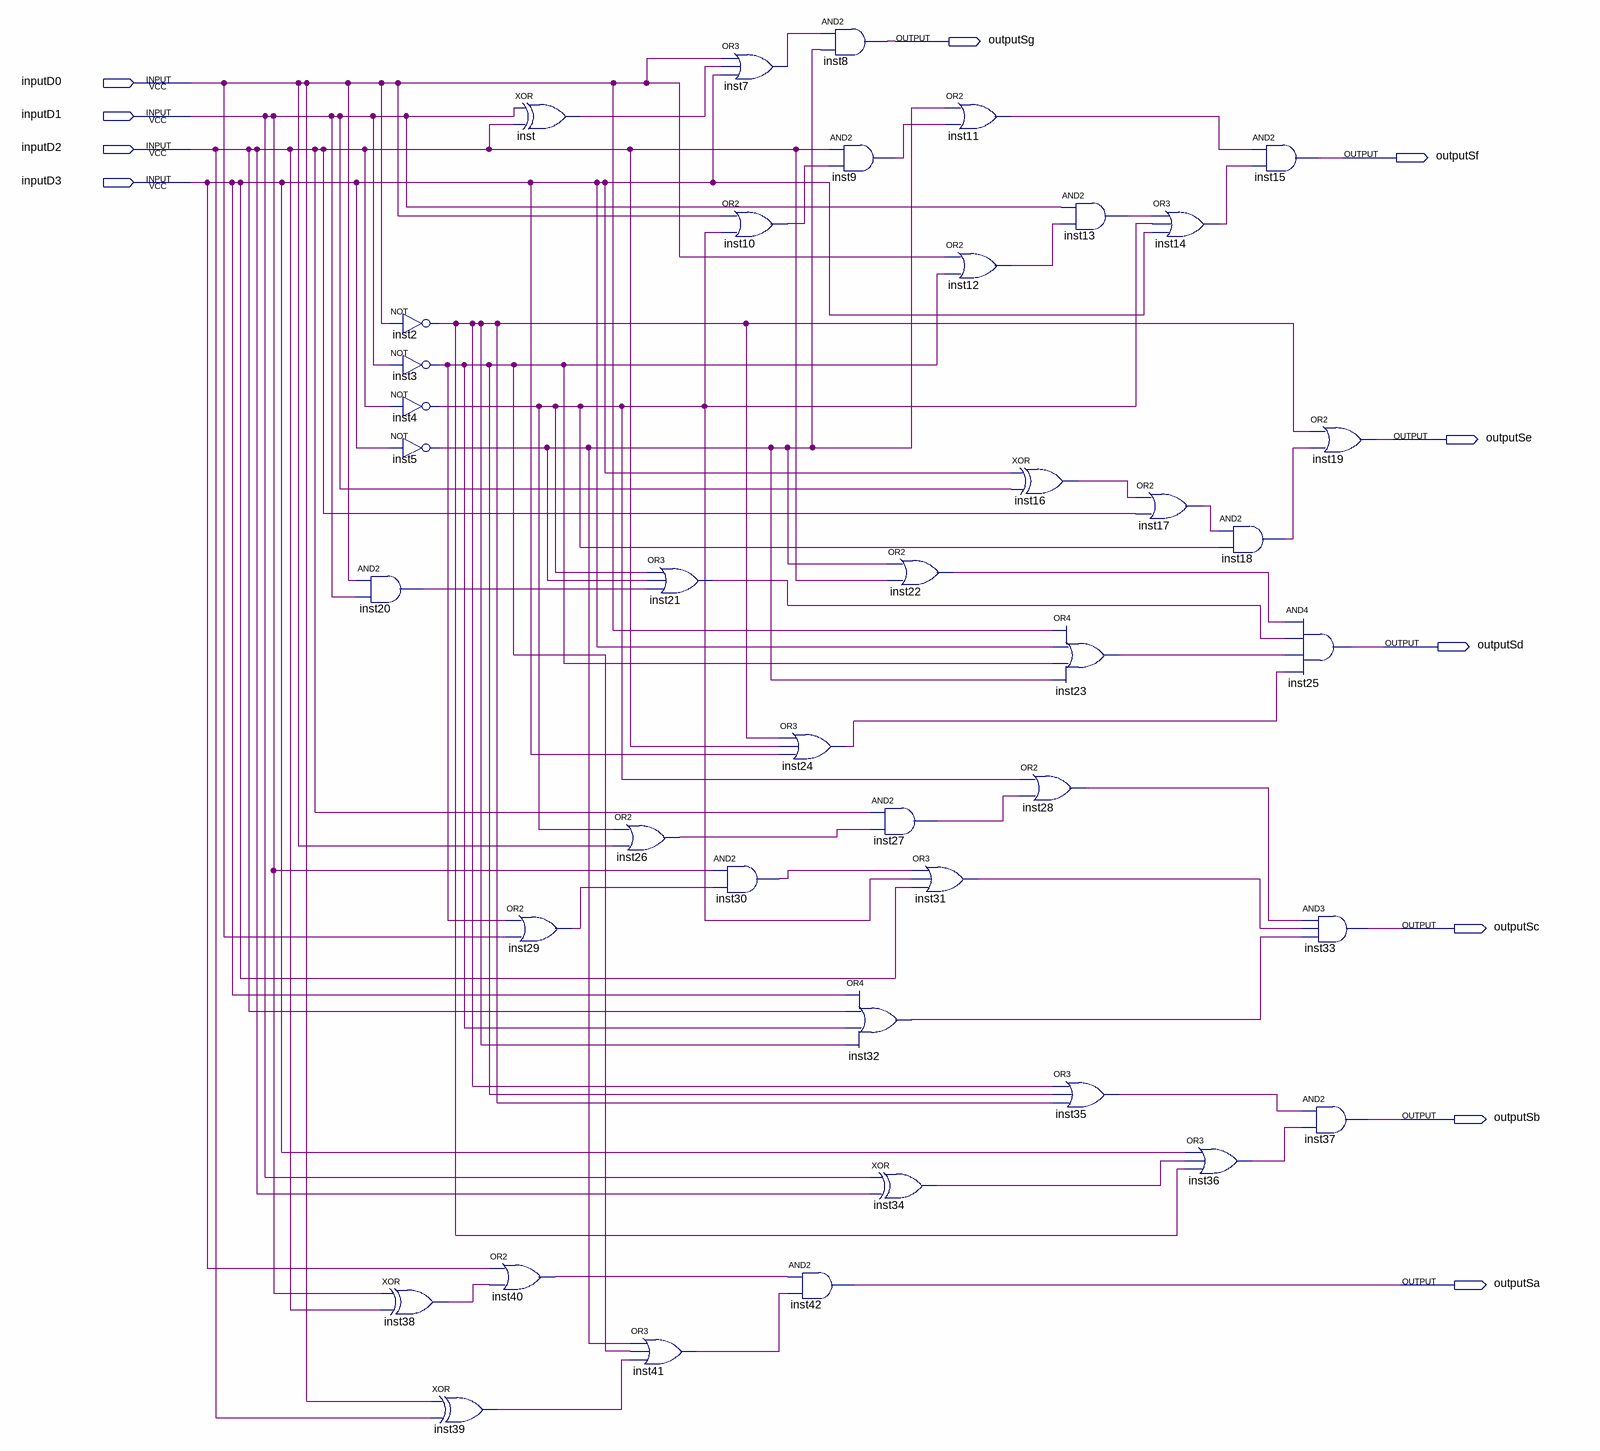
[diagram p0: schematic sheet]
// Quartus schematic Lab3.bdf as structural Verilog: 41 symbols, 11 pins
module Lab3 (
  input  inputD0,
  input  inputD1,
  input  inputD2,
  input  inputD3,
  output outputSg,
  output outputSf,
  output outputSe,
  output outputSd,
  output outputSc,
  output outputSb,
  output outputSa
);

  wire inst2_out, inst3_out, inst4_out, inst5_out, inst7_out, inst9_out, inst10_out, inst11_out, inst12_out,
       inst13_out, inst14_out, inst16_out, inst17_out, inst18_out, inst20_out, inst21_out, inst22_out,
       inst23_out, inst24_out, inst26_out, inst27_out, inst28_out, inst29_out, inst30_out, inst31_out,
       inst32_out, inst34_out, inst35_out, inst36_out, inst38_out, inst39_out, inst40_out, inst41_out,
       inst_out;

  and inst20 (inst20_out, inputD0, inputD1);
  not inst2 (inst2_out, inputD0);
  not inst3 (inst3_out, inputD1);
  not inst4 (inst4_out, inputD2);
  not inst5 (inst5_out, inputD3);
  xor inst38 (inst38_out, inputD1, inputD2);
  xor inst39 (inst39_out, inputD0, inputD2);
  or inst40 (inst40_out, inputD3, inst38_out);
  xor inst (inst_out, inputD1, inputD2);
  or inst29 (inst29_out, inst3_out, inputD0);
  or inst26 (inst26_out, inst4_out, inputD0);
  or inst41 (inst41_out, inst5_out, inst3_out, inst39_out);
  or inst21 (inst21_out, inst4_out, inst5_out, inst20_out);
  or inst7 (inst7_out, inputD0, inst_out, inputD3);
  or inst10 (inst10_out, inputD0, inst4_out);
  and inst30 (inst30_out, inputD1, inst29_out);
  and inst8 (outputSg, inst7_out, inst5_out);
  and inst9 (inst9_out, inputD2, inst10_out);
  or inst24 (inst24_out, inst2_out, inputD2, inputD3);
  and inst42 (outputSa, inst40_out, inst41_out);
  or inst22 (inst22_out, inst5_out, inputD2);
  and inst27 (inst27_out, inputD2, inst26_out);
  or inst32 (inst32_out, inputD3, inputD2, inst3_out, inst2_out);
  xor inst34 (inst34_out, inputD1, inputD2);
  or inst11 (inst11_out, inst5_out, inst9_out);
  or inst12 (inst12_out, inputD0, inst3_out);
  or inst31 (inst31_out, inst30_out, inst4_out, inputD3);
  xor inst16 (inst16_out, inputD3, inputD1);
  or inst28 (inst28_out, inst4_out, inst27_out);
  and inst13 (inst13_out, inputD1, inst12_out);
  or inst23 (inst23_out, inputD0, inputD3, inst3_out, inst5_out);
  or inst35 (inst35_out, inst2_out, inst3_out, inst2_out);
  or inst14 (inst14_out, inst13_out, inst4_out, inputD3);
  or inst17 (inst17_out, inst16_out, inputD2);
  and inst18 (inst18_out, inst17_out, inst4_out);
  or inst36 (inst36_out, inputD3, inst34_out, inst2_out);
  and inst15 (outputSf, inst11_out, inst14_out);
  and inst25 (outputSd, inst22_out, inst21_out, inst23_out, inst24_out);
  or inst19 (outputSe, inst2_out, inst18_out);
  and inst33 (outputSc, inst28_out, inst31_out, inst32_out);
  and inst37 (outputSb, inst35_out, inst36_out);
endmodule
